# EAGLE schematic inductor_test (EAGLE 6.5.0)

## Sheet 1 of 2
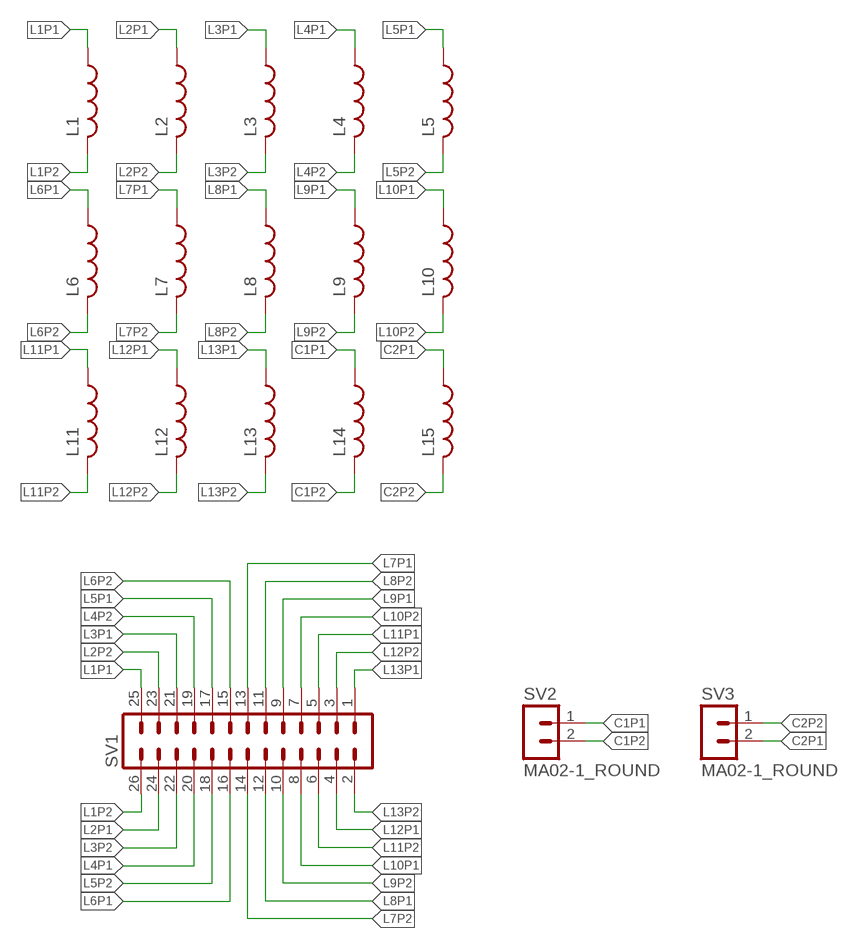
[diagram p0: schematic, sheet 1]

### Parts
L1  L-USL0805  [L0805]
L2  L-USL0805  [L0805]
L3  L-USL0805  [L0805]
L4  L-USL0805  [L0805]
L5  L-USL0805  [L0805]
L6  L-USL0805  [L0805]
L7  L-USL0805  [L0805]
L8  L-USL0805  [L0805]
L9  L-USL0805  [L0805]
L10  L-USL0805  [L0805]
L11  L-USL0805  [L0805]
L12  L-USL0805  [L0805]
L13  L-USL0805  [L0805]
L14  L-USL0805  [L0805]
L15  L-USL0805  [L0805]
SV1  MA13-2BARE  [MA13-2_BARE]
SV2  MA02-1_ROUND  [MA02-1_ROUND]
SV3  MA02-1_ROUND  [MA02-1_ROUND]

### Nets
C1P1: L14.1 SV2.1
C1P2: L14.2 SV2.2
C2P1: L15.1 SV3.2
C2P2: L15.2 SV3.1
L1P1: L1.1 SV1.25
L1P2: L1.2 SV1.26
L2P1: L2.1 SV1.24
L2P2: L2.2 SV1.23
L3P1: L3.1 SV1.21
L3P2: L3.2 SV1.22
L4P1: L4.1 SV1.20
L4P2: L4.2 SV1.19
L5P1: L5.1 SV1.17
L5P2: L5.2 SV1.18
L6P1: L6.1 SV1.16
L6P2: L6.2 SV1.15
L7P1: L7.1 SV1.13
L7P2: L7.2 SV1.14
L8P1: L8.1 SV1.12
L8P2: L8.2 SV1.11
L9P1: L9.1 SV1.9
L9P2: L9.2 SV1.10
L10P1: L10.1 SV1.8
L10P2: L10.2 SV1.7
L11P1: L11.1 SV1.5
L11P2: L11.2 SV1.6
L12P1: L12.1 SV1.4
L12P2: L12.2 SV1.3
L13P1: L13.1 SV1.1
L13P2: L13.2 SV1.2

## Sheet 2 of 2
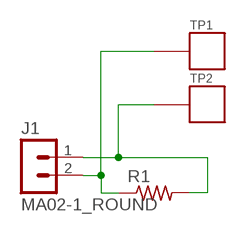
[diagram p1: schematic, sheet 2]

### Parts
J1  MA02-1_ROUND  [MA02-1_ROUND]
R1  R-US_R0603  [R0603]
TP1  TP_STD  [TP]
TP2  TP_STD  [TP]

### Nets
N$1: J1.2 R1.1 TP1.P$1
N$2: J1.1 R1.2 TP2.P$1

## Library data of the parts
J1 SV2 SV3 = con-lstb:MA02-1_ROUND; DIGIKEY: NP
L1-L15 = rcl:L-US: INDUCTOR, American symbol
R1 = rcl:R-US_: RESISTOR, American symbol; DIGIKEY: P49.9HCT-ND; DIGIKEY_2: P220JCT-ND
SV1 = con-lstb:MA13-2: PIN HEADER; DIGIKEY: 3M9464-ND
TP1 TP2 = skyspecs:TP; DIGIKEY: NP